# EAGLE schematic dartBoardV1 (EAGLE 9.5.0)
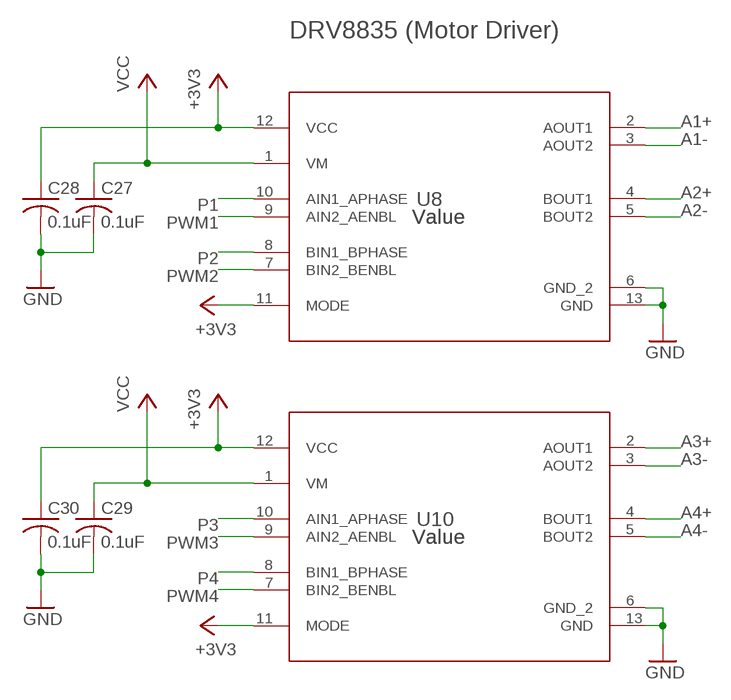
[diagram p0: schematic, sheet 1, part 1 of 2]
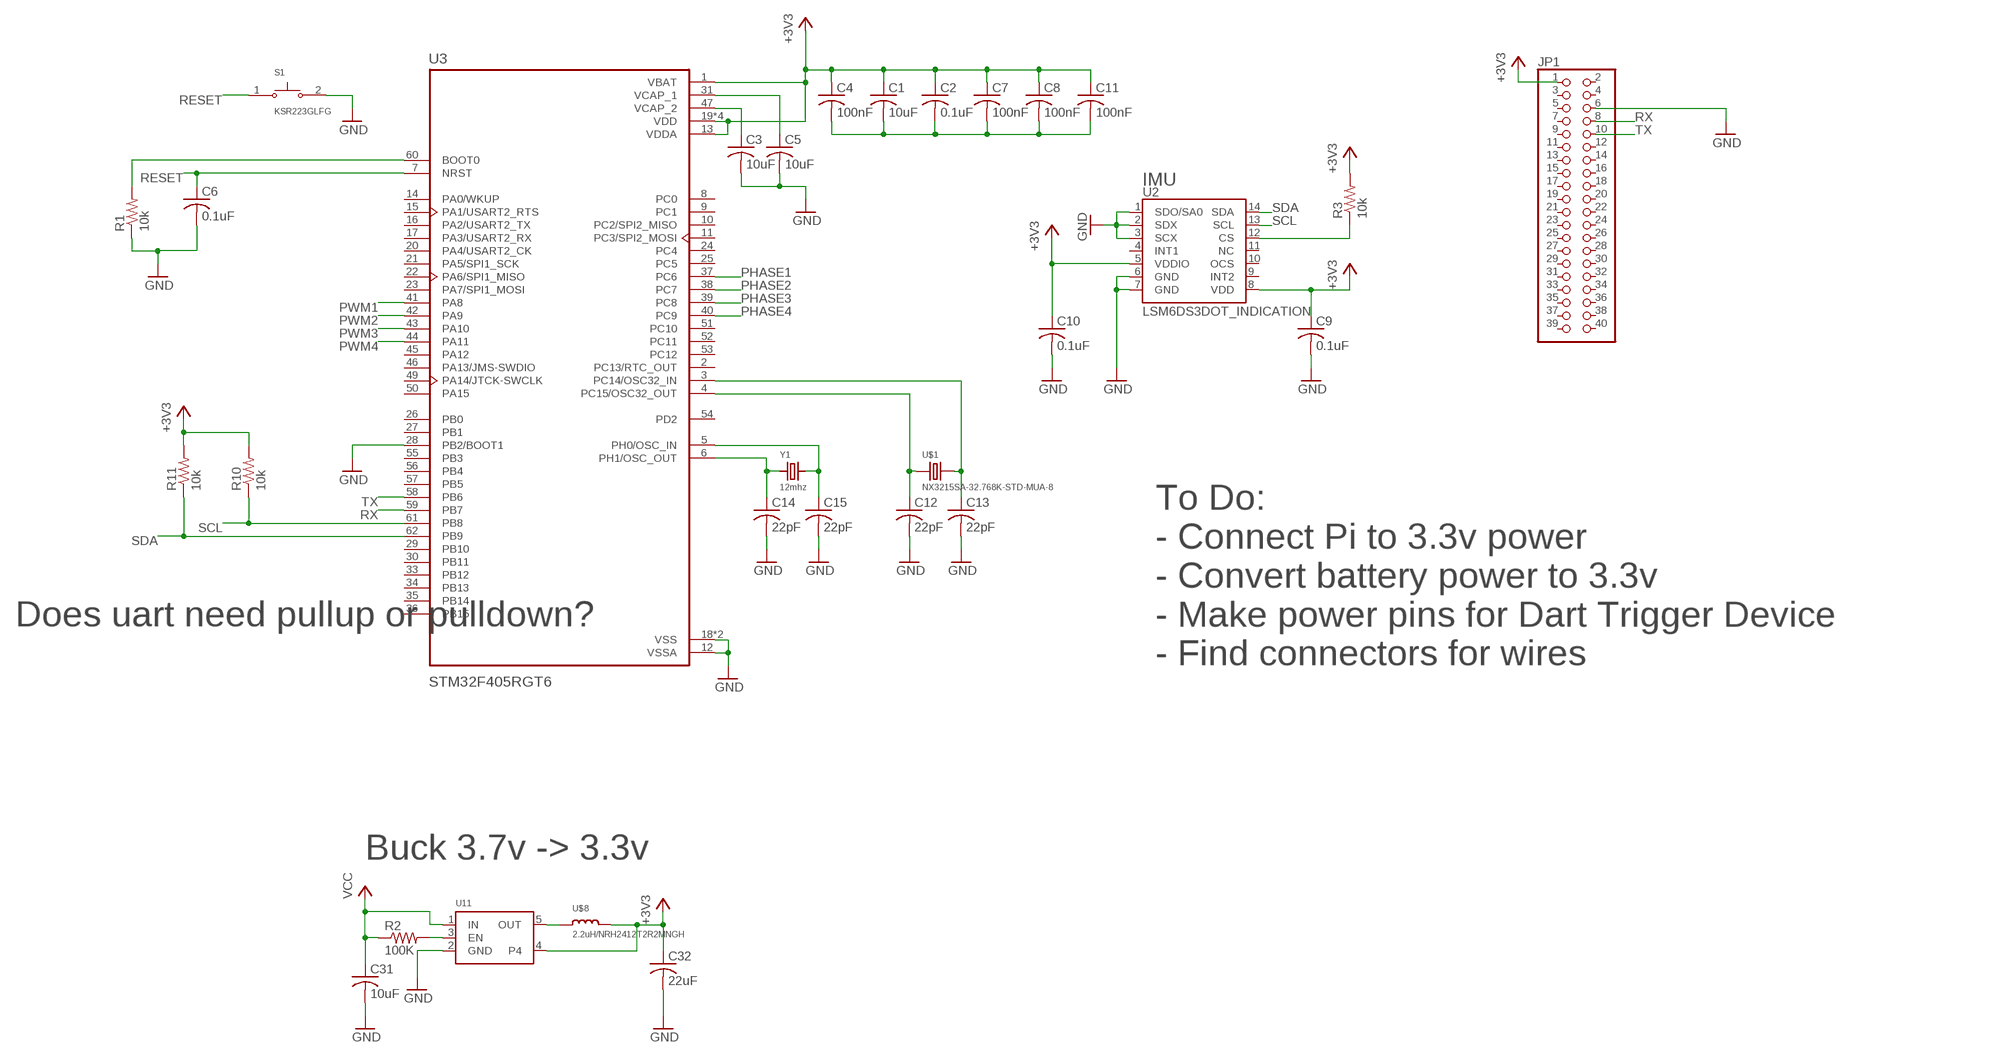
[diagram p1: schematic, sheet 1, part 2 of 2]

## Parts
C1  10uF  C-USC0603  [C0603]
C2  0.1uF  C-USC0603  [C0603]
C3  10uF  C-USC0603  [C0603]
C4  100nF  C-USC0603  [C0603]
C5  10uF  C-USC0603  [C0603]
C6  0.1uF  C-USC0603  [C0603]
C7  100nF  C-USC0603  [C0603]
C8  100nF  C-USC0603  [C0603]
C9  0.1uF  C-USC0603  [C0603]
C10  0.1uF  C-USC0603  [C0603]
C11  100nF  C-USC0603  [C0603]
C12  22pF  C-USC0603  [C0603]
C13  22pF  C-USC0603  [C0603]
C14  22pF  C-USC0603  [C0603]
C15  22pF  C-USC0603  [C0603]
C27  0.1uF  C-USC0603  [C0603]
C28  0.1uF  C-USC0603  [C0603]
C29  0.1uF  C-USC0603  [C0603]
C30  0.1uF  C-USC0603  [C0603]
C31  10uF  C-USC0603  [C0603]
C32  22uF  C-USC0603  [C0603]
JP1  PINHD-2X20  [2X20]
R1  10k  R-US_R0603  [R0603]
R2  100K  R-US_R0603  [R0603]
R3  10k  R-US_R0603  [R0603]
R10  10k  R-US_R0603  [R0603]
R11  10k  R-US_R0603  [R0603]
S1  KSR223GLFG  [SW_KSR223GLFG]
U2  LSM6DS3DOT_INDICATION  [LGA14L_DOT_INDICATOR]
U3  STM32F405RGT6  [QFP50P1200X1200X160-64N]
U8  Value  DRV8835DSSR  [DSS0012A]
U10  Value  DRV8835DSSR  [DSS0012A]
U11  VREG_SOT23-5  [SOT23-5]
U$1  NX3215SA-32.768K-STD-MUA-8  [NX3215SA-32.768K-STD-MUA-8]
U$8  2.2uH/NRH2412T2R2MNGH  MDKK1616T2R2MM  [MDKK1616T2R2MM]
Y1  12mhz  CRYSTAL2.5X2.0MM  [CRYSTAL_2.5X2]

## Nets
+3V3: C1.1 C2.1 C4.1 C7.1 C8.1 C9.1 C10.1 C11.1 C28.1 C30.1 C32.1 JP1.1 R3.2 R10.2 R11.2 U2.5(VDDIO) U2.8(VDD) U3.1(VBAT) U3.13(VDDA) U3.19(VDD) U3.32(VDD) U3.48(VDD) U3.64(VDD) U8.11(MODE) U8.12(VCC) U10.11(MODE) U10.12(VCC) U11.4 U$8.P$2
A1+: U8.2(AOUT1)
A1-: U8.3(AOUT2)
A2+: U8.4(BOUT1)
A2-: U8.5(BOUT2)
A3+: U10.2(AOUT1)
A3-: U10.3(AOUT2)
A4+: U10.4(BOUT1)
A4-: U10.5(BOUT2)
GND: C3.2 C5.2 C6.2 C9.2 C10.2 C12.2 C13.2 C14.2 C15.2 C27.2 C28.2 C29.2 C30.2 C31.2 C32.2 JP1.6 R1.1 S1.2 U2.1(SDO/SA0) U2.2(SDX) U2.3(SCX) U2.6(GND) U2.7(GND) U3.12(VSSA) U3.18(VSS) U3.28(PB2/BOOT1) U3.63(VSS) U8.6(GND_2) U8.13(GND) U10.6(GND_2) U10.13(GND) U11.2(GND)
N$1: R3.1 U2.12(CS)
N$2: C12.1 U3.4(PC15/OSC32_OUT) U$1.P$1
N$3: C1.2 C2.2 C4.2 C7.2 C8.2 C11.2
N$4: C13.1 U3.3(PC14/OSC32_IN) U$1.P$2
N$5: C5.1 U3.31(VCAP_1)
N$6: C3.1 U3.47(VCAP_2)
N$7: R1.2 U3.60(BOOT0)
N$8: C14.1 U3.6(PH1/OSC_OUT) Y1.1
N$9: C15.1 U3.5(PH0/OSC_IN) Y1.3
N$17: R2.2 U11.3(EN)
N$18: U11.5(OUT) U$8.P$1
P1: U8.10(AIN1_APHASE)
P2: U8.8(BIN1_BPHASE)
P3: U10.10(AIN1_APHASE)
P4: U10.8(BIN1_BPHASE)
PHASE1: U3.37(PC6)
PHASE2: U3.38(PC7)
PHASE3: U3.39(PC8)
PHASE4: U3.40(PC9)
PWM1: U3.41(PA8) U8.9(AIN2_AENBL)
PWM2: U3.42(PA9) U8.7(BIN2_BENBL)
PWM3: U3.43(PA10) U10.9(AIN2_AENBL)
PWM4: U3.44(PA11) U10.7(BIN2_BENBL)
RESET: C6.1 S1.1 U3.7(NRST)
RX: JP1.8 U3.59(PB7)
SCL: R10.1 U2.13(SCL) U3.61(PB8)
SDA: R11.1 U2.14(SDA) U3.62(PB9)
TX: JP1.10 U3.58(PB6)
VCC: C27.1 C29.1 C31.1 R2.1 U8.1(VM) U10.1(VM) U11.1(IN)
Unconnected: JP1.2 JP1.3 JP1.4 JP1.5 JP1.7 JP1.9 JP1.11 JP1.12 JP1.13 JP1.14 JP1.15 JP1.16 JP1.17 JP1.18 JP1.19 JP1.20 JP1.21 JP1.22 JP1.23 JP1.24 JP1.25 JP1.26 JP1.27 JP1.28 JP1.29 JP1.30 JP1.31 JP1.32 JP1.33 JP1.34 JP1.35 JP1.36 JP1.37 JP1.38 JP1.39 JP1.40 U2.4(INT1) U2.9(INT2) U2.10(OCS) U2.11(NC) U3.2(PC13/RTC_OUT) U3.8(PC0) U3.9(PC1) U3.10(PC2/SPI2_MISO) U3.11(PC3/SPI2_MOSI) U3.14(PA0/WKUP) U3.15(PA1/USART2_RTS) U3.16(PA2/USART2_TX) U3.17(PA3/USART2_RX) U3.20(PA4/USART2_CK) U3.21(PA5/SPI1_SCK) U3.22(PA6/SPI1_MISO) U3.23(PA7/SPI1_MOSI) U3.24(PC4) U3.25(PC5) U3.26(PB0) U3.27(PB1) U3.29(PB10) U3.30(PB11) U3.33(PB12) U3.34(PB13) U3.35(PB14) U3.36(PB15) U3.45(PA12) U3.46(PA13/JMS-SWDIO) U3.49(PA14/JTCK-SWCLK) U3.50(PA15) U3.51(PC10) U3.52(PC11) U3.53(PC12) U3.54(PD2) U3.55(PB3) U3.56(PB4) U3.57(PB5)

## Notes on the sheet
- IMU
- DRV8835 (Motor Driver)
- Does uart need pullup or pulldown?
- To Do:
  - Connect Pi to 3.3v power
  - Convert battery power to 3.3v
  - Make power pins for Dart Trigger Device
  - Find connectors for wires
- Buck 3.7v -> 3.3v

## Library data of the parts
C1-C15 C27-C32 = rcl:C-US: CAPACITOR, American symbol; SPICEPREFIX: C
JP1 = adafruit:PINHD-2X20: PIN HEADER
R1-R3 R10 R11 = rcl:R-US_: RESISTOR, American symbol; SPICEPREFIX: R
S1 = _HenrySilva:KSR223GLFG: Switch Tactile N.O. SPST Round Button Gull Wing 0.01A 32VDC 0.2VA 200000Cycles 2N SMD Automotive T/R; DESCRIPTION: Tactile Switch SPST-NO Top Actuated Surface Mount; DIGI-KEY_PART_NUMBER: 401-1704-1-ND; DIGI-KEY_PURCHASE_URL: https://www.digikey.com/product-detail/en/c-k/KSR223GLFG/401-1704-1-ND/958078?utm_source=snapeda&utm_medium=aggregator&utm_campaign=symbol; MF: C&K; MP: KSR223GLFG; PACKAGE: None
U2 = _HenrySilva:LSM6DS3; PROD_ID: IC-12969
U3 = _HenrySilva:STM32F405RGT6: High-performance foundation line, ARM Cortex-M4 core with DSP and FPU, 1 Mbyte Flash, 168 MHz CPU, ART Accelerator; DESCRIPTION: ARM® Cortex®-M4 STM32F4 Microcontroller IC 32-Bit 168MHz 1MB _1M x 8_ FLASH 64-LQFP _10x10_; DIGI-KEY_PART_NUMBER: 497-11767-ND; DIGI-KEY_PURCHASE_URL: https://www.digikey.com/product-detail/en/stmicroelectronics/STM32F405RGT6/497-11767-ND/2754208?utm_source=snapeda&utm_medium=aggregator&utm_campaign=symbol; MF: STMicroelectronics; MP: STM32F405RGT6; PACKAGE: LQFP-64 STMicroelectronics
U8 U10 = _HenrySilva:DRV8835DSSR; MANUFACTURER: Texas Instruments; PARTNUMBER: DRV8835DSSR; REFDES: RefDes; TYPE: TYPE
U11 = microbuilder:VREG_SOT23-5: SOT23-5 Fixed Voltage Regulators To better organise some of the SOT23-5 fixed voltage regulators in this library, this new part was created. Part Current Out V Out V In V Dropout Digikey Part No. ADP121 150mA 3.3V 3.4-5.5V 0.09V @ 150mA ADP121-AUJZ33R7CT-ND ADP121 150mA 3.0V 3.1-5.5V 0.09V @ 150mA ADP121-AUJZ30R7CT-ND ADP122 300mA 3.3V 3.4-5.5V 0.085V @ 300mA ADP122AUJZ-3.3-R7CT-ND ADP1712 300mA 3.3V 3.5-5.5V 0.17V @ 300mA ADP1712AUJZ-3.3-R7TR-ND AP7311 (Low Cost) 150mA 3.3V 3.5-6V 0.15V @ 150mA AP7311-33WG-7DICT-ND LD39015M18R 150mA 1.8V 1.9V-5.5V 0.08V @ 100mA 497-6977-1-ND MCP1824T-3302E/OT 300mA 3.3V 3.5V-6V 0.2V @ 300mA MCP1824T-3302E/OTCT-ND MIC5205-2.5YM5 TR 150mA 2.5V 2.7-16V 0.165V @ 150mA 576-1257-2-ND MIC5205-3.0YM5 TR 150mA 3.0V 3.2V-16V 0.165V @ 150mA 576-1258-2-ND MIC5205-3.3YM5 TR 150mA 3.3V 3.5V-16V 0.165V @ 150mA 576-1259-2-ND TPS780330220 150mA 3.3V+2.2V 3.6-5.5V 250mV Max 296-23332-1-ND TDA3663/N1,135 100mA 3.3V 3.5-45V 0.18V @ 50mA 568-5343-1-ND
U$1 = _HenrySilva:NX3215SA-32.768K-STD-MUA-8
U$8 = HenrySilva:MDKK1616T2R2MM
Y1 = microbuilder:CRYSTAL: Crystals HC49UP - Surface Mount Crystal 4.0MHz 18pF +/-30ppm Surface Mount Crystal [Digikey: 535-9857-1-ND] 12.0 MHz Surface Mount Crystal [Digikey: 535-9869-6-ND] 25.0 MHz Surface Mount Crystal [Digikey: 535-9078-1-ND] 2.5 x 2.0mm - MEMs SMT Crystal 16.0 MHz 10pF 20ppm 2.5 x 2.0mm Crystal [Digikey -40-85°C: 535-10923-1-ND] 3.2 x 2.5mm - MEMs SMT Crystal 12.0 MHz 8pF 15ppm 3.2 x 2.5mm Crystal [Digikey: -10-70°C: 644-1047-1-ND -40-125°C: 644-1128-1-ND] 16.0 MHz 8pF 15ppm 3.2 x 2.5mm Crystal [Digikey: -10-70°C: 644-1049-1-ND -40-125°C: 644-1129-2-ND] 16.0 MHz 10pF 10ppm 3.2 x 2.5mm Crystal [Digikey: 644-1100-1-ND] 27.12 MHz 18pF 30ppm 3.2 x 2.5mm Crystal [Digikey: 887-1424-1-ND] 27.12MHz 10pF 10ppm 3.2 x 2.5mm Crystal [Digikey: 887-1329-1-ND] 4.9 x 1.8mm - MEMs SMT Crystal 32.768 KHz 12.5pF 20ppm 4.9 x 1.8mm Crystal [Digikey: SE2415CT-ND] 8.0 x 3.8mm - Surface Mount Crystal 32.768kHz 12.5pF 20ppm -40°C-85°C [Digikey: 535-9166-2-ND] Cylinder 32.768KHz Cylinder Crystal (2x6mm body) [Ex. Digikey: 300-8341-2-ND]